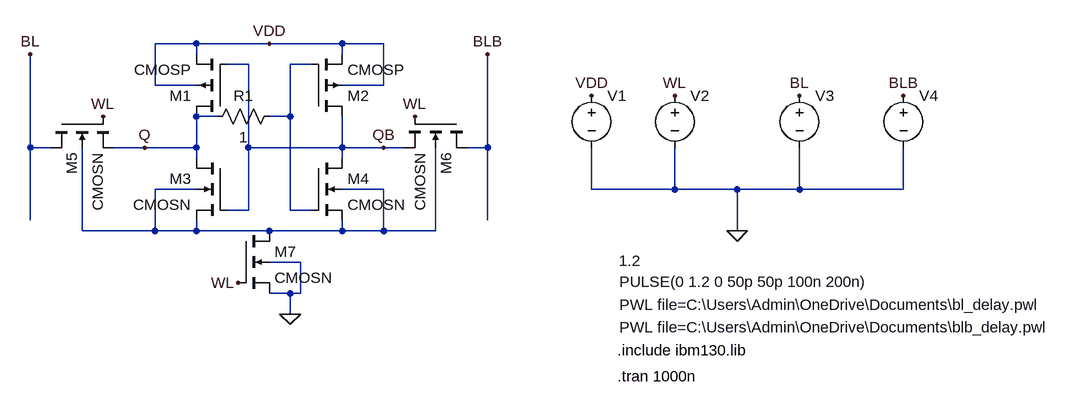
[diagram p0: schematic 7T CMOS.asc]
7T CMOS.asc, the LTspice schematic file:
Version 4
SHEET 1 1828 680
WIRE 48 -16 -16 -16
WIRE 160 -16 48 -16
WIRE 272 -16 160 -16
WIRE 336 -16 272 -16
WIRE 48 0 48 -16
WIRE 272 0 272 -16
WIRE 128 16 96 16
WIRE 224 16 192 16
WIRE -16 48 -16 -16
WIRE 48 48 -16 48
WIRE 336 48 336 -16
WIRE 336 48 272 48
WIRE 80 96 48 96
WIRE 192 96 192 16
WIRE 192 96 160 96
WIRE -208 144 -208 0
WIRE -176 144 -208 144
WIRE -32 144 -80 144
WIRE 48 144 48 96
WIRE 48 144 -32 144
WIRE 128 144 128 16
WIRE 272 144 272 96
WIRE 272 144 128 144
WIRE 336 144 272 144
WIRE 368 144 336 144
WIRE 496 144 496 0
WIRE 496 144 464 144
WIRE 48 160 48 144
WIRE 272 160 272 144
WIRE 48 208 -16 208
WIRE 336 208 272 208
WIRE 656 208 656 144
WIRE 784 208 784 144
WIRE 784 208 656 208
WIRE 880 208 784 208
WIRE 976 208 976 144
WIRE 976 208 880 208
WIRE 1136 208 1136 144
WIRE 1136 208 976 208
WIRE 128 240 128 144
WIRE 128 240 96 240
WIRE 192 240 192 96
WIRE 224 240 192 240
WIRE -208 256 -208 144
WIRE 496 256 496 144
WIRE -128 272 -128 144
WIRE -16 272 -16 208
WIRE -16 272 -128 272
WIRE 48 272 48 256
WIRE 48 272 -16 272
WIRE 160 272 48 272
WIRE 272 272 272 256
WIRE 272 272 160 272
WIRE 336 272 336 208
WIRE 336 272 272 272
WIRE 416 272 416 144
WIRE 416 272 336 272
WIRE 880 272 880 208
WIRE 208 320 160 320
WIRE 192 368 160 368
WIRE 208 368 208 320
WIRE 208 368 192 368
WIRE 192 400 192 368
FLAG 192 400 0
FLAG 112 352 WL
FLAG -96 96 WL
FLAG 384 96 WL
FLAG 160 -16 VDD
FLAG -32 144 Q
FLAG 336 144 QB
FLAG -208 0 BL
FLAG 496 0 BLB
FLAG 880 272 0
FLAG 656 64 VDD
FLAG 784 64 WL
FLAG 976 64 BL
FLAG 1136 64 BLB
SYMBOL CMOSN 96 160 M0
SYMATTR InstName M3
SYMATTR Value2 l=130nm w=130nm
SYMBOL CMOSN 224 160 R0
SYMATTR InstName M4
SYMATTR Value2 l=130nm w=130nm
SYMBOL CMOSP 96 96 R180
SYMATTR InstName M1
SYMATTR Value2 l=130nm w=130nm
SYMBOL CMOSP 224 96 M180
SYMATTR InstName M2
SYMATTR Value2 l=130nm w=130nm
SYMBOL CMOSN -176 96 M90
SYMATTR InstName M5
SYMATTR Value2 l=130nm w=130nm
SYMBOL CMOSN 464 96 R90
SYMATTR InstName M6
SYMATTR Value2 l=130nm w=130nm
SYMBOL CMOSN 112 272 R0
SYMATTR InstName M7
SYMATTR Value2 l=130nm w=130nm
SYMBOL voltage 656 48 R0
WINDOW 3 42 270 Left 2
WINDOW 123 0 0 Left 0
WINDOW 39 0 0 Left 0
SYMATTR Value 1.2
SYMATTR InstName V1
SYMBOL voltage 784 48 R0
WINDOW 3 -85 302 Left 2
WINDOW 123 0 0 Left 0
WINDOW 39 0 0 Left 0
SYMATTR Value PULSE(0 1.2 0 50p 50p 100n 200n)
SYMATTR InstName V2
SYMBOL voltage 976 48 R0
WINDOW 3 -277 338 Left 2
WINDOW 123 0 0 Left 0
WINDOW 39 0 0 Left 0
SYMATTR Value PWL file=C:\Users\Admin\OneDrive\Documents\bl_delay.pwl
SYMATTR InstName V3
SYMBOL voltage 1136 48 R0
WINDOW 3 -437 372 Left 2
WINDOW 123 0 0 Left 0
WINDOW 39 0 0 Left 0
SYMATTR Value PWL file=C:\Users\Admin\OneDrive\Documents\blb_delay.pwl
SYMATTR InstName V4
SYMBOL res 176 80 R90
WINDOW 0 0 56 VBottom 2
WINDOW 3 32 56 VTop 2
SYMATTR InstName R1
SYMATTR Value 1
TEXT 696 456 Left 2 !.include ibm130.lib
TEXT 696 496 Left 2 !.tran 1000n

The netlist it stands for:
* 7T CMOS.asc
M3 Q QB N002 N002 CMOSN l=130nm w=130nm
M4 QB N001 N002 N002 CMOSN l=130nm w=130nm
M1 Q QB VDD VDD CMOSP l=130nm w=130nm
M2 QB N001 VDD VDD CMOSP l=130nm w=130nm
M5 BL WL Q N002 CMOSN l=130nm w=130nm
M6 BLB WL QB N002 CMOSN l=130nm w=130nm
M7 N002 WL 0 0 CMOSN l=130nm w=130nm
V1 VDD 0 1.2
V2 WL 0 PULSE(0 1.2 0 50p 50p 100n 200n)
V3 BL 0 PWL file=C:\Users\Admin\OneDrive\Documents\bl_delay.pwl
V4 BLB 0 PWL file=C:\Users\Admin\OneDrive\Documents\blb_delay.pwl
R1 N001 Q 1
.model NMOS NMOS
.model PMOS PMOS
.lib standard.mos
.include ibm130.lib
.tran 1000n
.backanno
.end